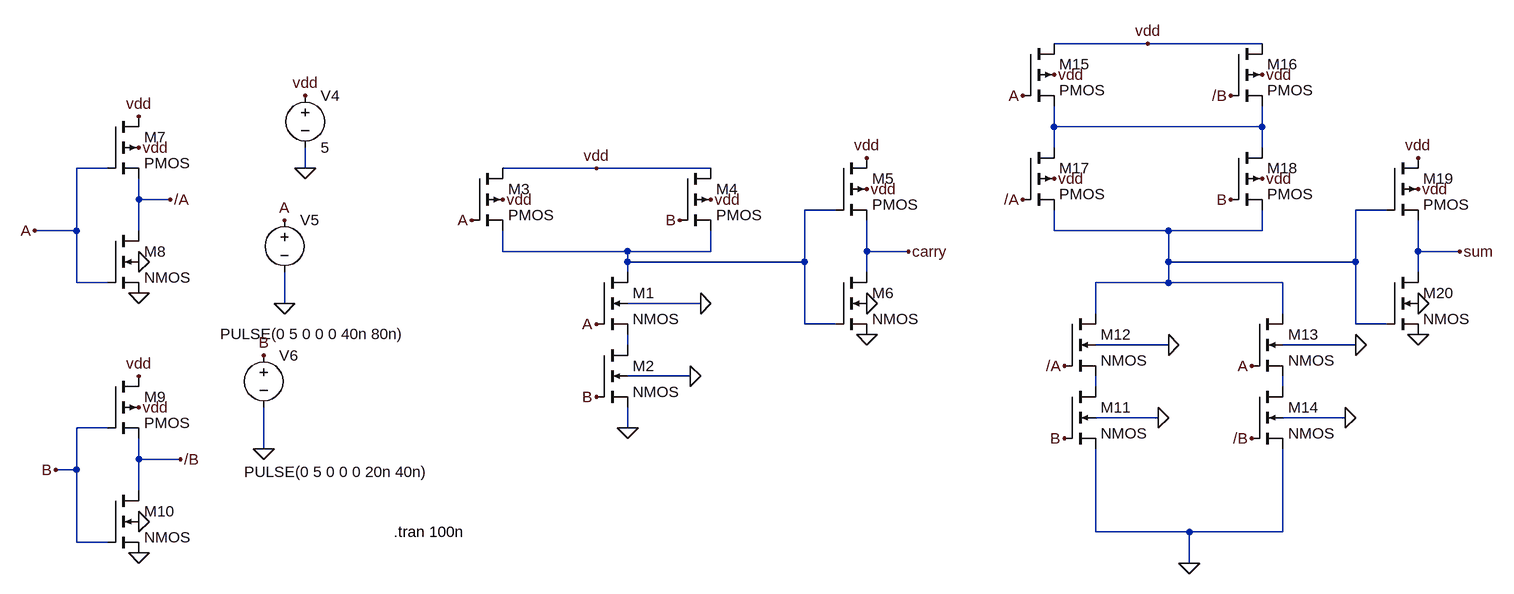
[diagram p0: schematic static_cmos_2.asc]
static_cmos_2.asc, the LTspice schematic file:
Version 4
SHEET 1 1772 680
WIRE 1040 -224 896 -224
WIRE 1216 -224 1040 -224
WIRE 896 -96 896 -128
WIRE 1216 -96 1216 -128
WIRE 1216 -96 896 -96
WIRE 896 -64 896 -96
WIRE 1216 -64 1216 -96
WIRE -560 -32 -608 -32
WIRE -256 -32 -256 -64
WIRE 192 -32 48 -32
WIRE 368 -32 192 -32
WIRE -512 16 -512 -16
WIRE -464 16 -512 16
WIRE 560 32 512 32
WIRE 1408 32 1360 32
WIRE -608 64 -608 -32
WIRE -608 64 -672 64
WIRE -512 64 -512 16
WIRE 896 64 896 32
WIRE 1072 64 896 64
WIRE 1216 64 1216 32
WIRE 1216 64 1072 64
WIRE 48 96 48 64
WIRE 240 96 48 96
WIRE 368 96 368 64
WIRE 368 96 240 96
WIRE 608 96 608 48
WIRE 672 96 608 96
WIRE 1456 96 1456 48
WIRE 1520 96 1456 96
WIRE 240 112 240 96
WIRE 512 112 512 32
WIRE 512 112 240 112
WIRE 1072 112 1072 64
WIRE 1360 112 1360 32
WIRE 1360 112 1072 112
WIRE 240 128 240 112
WIRE 608 128 608 96
WIRE 1456 128 1456 96
WIRE -608 144 -608 64
WIRE -560 144 -608 144
WIRE 1072 144 1072 112
WIRE 1072 144 960 144
WIRE 1248 144 1072 144
WIRE -288 176 -288 128
WIRE 352 176 240 176
WIRE 960 192 960 144
WIRE 1248 192 1248 144
WIRE 512 208 512 112
WIRE 560 208 512 208
WIRE 1360 208 1360 112
WIRE 1408 208 1360 208
WIRE 240 240 240 224
WIRE 1072 240 960 240
WIRE 1360 240 1248 240
WIRE 336 288 240 288
WIRE 960 304 960 288
WIRE 1248 304 1248 288
WIRE 1056 352 960 352
WIRE 1344 352 1248 352
WIRE -560 368 -608 368
WIRE 240 368 240 336
WIRE -320 400 -320 336
WIRE -512 416 -512 384
WIRE -448 416 -512 416
WIRE -608 432 -608 368
WIRE -608 432 -640 432
WIRE -512 464 -512 416
WIRE 960 528 960 400
WIRE 1104 528 960 528
WIRE 1248 528 1248 400
WIRE 1248 528 1104 528
WIRE -608 544 -608 432
WIRE -560 544 -608 544
WIRE 1104 576 1104 528
FLAG 192 -32 vdd
FLAG 240 368 0
FLAG 336 288 0
FLAG 352 176 0
FLAG 48 16 vdd
FLAG 368 16 vdd
FLAG 0 48 A
FLAG 192 208 A
FLAG 320 48 B
FLAG 192 320 B
FLAG 608 -48 vdd
FLAG 608 0 vdd
FLAG 608 176 0
FLAG 608 224 0
FLAG -256 -144 vdd
FLAG -256 -32 0
FLAG -288 176 0
FLAG -288 48 A
FLAG -320 400 0
FLAG -320 256 B
FLAG -512 -112 vdd
FLAG -512 -64 vdd
FLAG -512 112 0
FLAG -512 160 0
FLAG -512 288 vdd
FLAG -512 336 vdd
FLAG -512 512 0
FLAG -512 560 0
FLAG 672 96 carry
FLAG -464 16 /A
FLAG -448 416 /B
FLAG -672 64 A
FLAG -640 432 B
FLAG 1344 352 0
FLAG 1360 240 0
FLAG 1056 352 0
FLAG 1072 240 0
FLAG 912 384 B
FLAG 1200 272 A
FLAG 1104 576 0
FLAG 1040 -224 vdd
FLAG 896 -176 vdd
FLAG 1216 -176 vdd
FLAG 848 -144 A
FLAG 896 -16 vdd
FLAG 1216 -16 vdd
FLAG 1168 16 B
FLAG 1168 -144 /B
FLAG 1200 384 /B
FLAG 848 16 /A
FLAG 912 272 /A
FLAG 1456 -48 vdd
FLAG 1456 0 vdd
FLAG 1456 176 0
FLAG 1456 224 0
FLAG 1520 96 sum
SYMBOL nmos4 192 128 R0
SYMATTR InstName M1
SYMBOL nmos4 192 240 R0
SYMATTR InstName M2
SYMBOL pmos4 0 -32 R0
SYMATTR InstName M3
SYMBOL pmos4 320 -32 R0
SYMATTR InstName M4
SYMBOL pmos4 560 -48 R0
SYMATTR InstName M5
SYMBOL nmos4 560 128 R0
SYMATTR InstName M6
SYMBOL voltage -256 -160 R0
WINDOW 123 0 0 Left 0
WINDOW 39 0 0 Left 0
SYMATTR InstName V4
SYMATTR Value 5
SYMBOL voltage -288 32 R0
WINDOW 3 -99 191 Left 2
WINDOW 123 0 0 Left 0
WINDOW 39 0 0 Left 0
SYMATTR Value PULSE(0 5 0 0 0 40n 80n)
SYMATTR InstName V5
SYMBOL voltage -320 240 R0
WINDOW 3 -30 195 Left 2
WINDOW 123 0 0 Left 0
WINDOW 39 0 0 Left 0
SYMATTR Value PULSE(0 5 0 0 0 20n 40n)
SYMATTR InstName V6
SYMBOL pmos4 -560 -112 R0
SYMATTR InstName M7
SYMBOL nmos4 -560 64 R0
SYMATTR InstName M8
SYMBOL pmos4 -560 288 R0
SYMATTR InstName M9
SYMBOL nmos4 -560 464 R0
SYMATTR InstName M10
SYMBOL nmos4 1200 192 R0
SYMATTR InstName M13
SYMBOL nmos4 1200 304 R0
SYMATTR InstName M14
SYMBOL nmos4 912 304 R0
SYMATTR InstName M11
SYMBOL nmos4 912 192 R0
SYMATTR InstName M12
SYMBOL pmos4 848 -224 R0
SYMATTR InstName M15
SYMBOL pmos4 1168 -224 R0
SYMATTR InstName M16
SYMBOL pmos4 848 -64 R0
SYMATTR InstName M17
SYMBOL pmos4 1168 -64 R0
SYMATTR InstName M18
SYMBOL pmos4 1408 -48 R0
SYMATTR InstName M19
SYMBOL nmos4 1408 128 R0
SYMATTR InstName M20
TEXT -120 528 Left 2 !.tran 100n

The netlist it stands for:
* static_cmos_2.asc
M1 N002 A N004 0 NMOS
M2 N004 B 0 0 NMOS
M3 vdd A N002 vdd PMOS
M4 vdd B N002 vdd PMOS
M5 vdd N002 carry vdd PMOS
M6 carry N002 0 0 NMOS
V4 vdd 0 5
V5 A 0 PULSE(0 5 0 0 0 40n 80n)
V6 B 0 PULSE(0 5 0 0 0 20n 40n)
M7 vdd A /A vdd PMOS
M8 /A A 0 0 NMOS
M9 vdd B /B vdd PMOS
M10 /B B 0 0 NMOS
M13 N003 A N006 0 NMOS
M14 N006 /B 0 0 NMOS
M11 N005 B 0 0 NMOS
M12 N003 /A N005 0 NMOS
M15 vdd A N001 vdd PMOS
M16 vdd /B N001 vdd PMOS
M17 N001 /A N003 vdd PMOS
M18 N001 B N003 vdd PMOS
M19 vdd N003 sum vdd PMOS
M20 sum N003 0 0 NMOS
.model NMOS NMOS
.model PMOS PMOS
.lib standard.mos
.tran 100n
.backanno
.end